# Altium schematic sheet OZ440-SE140-CAR001_sheet4_Engagement_block.SchDoc
size A3
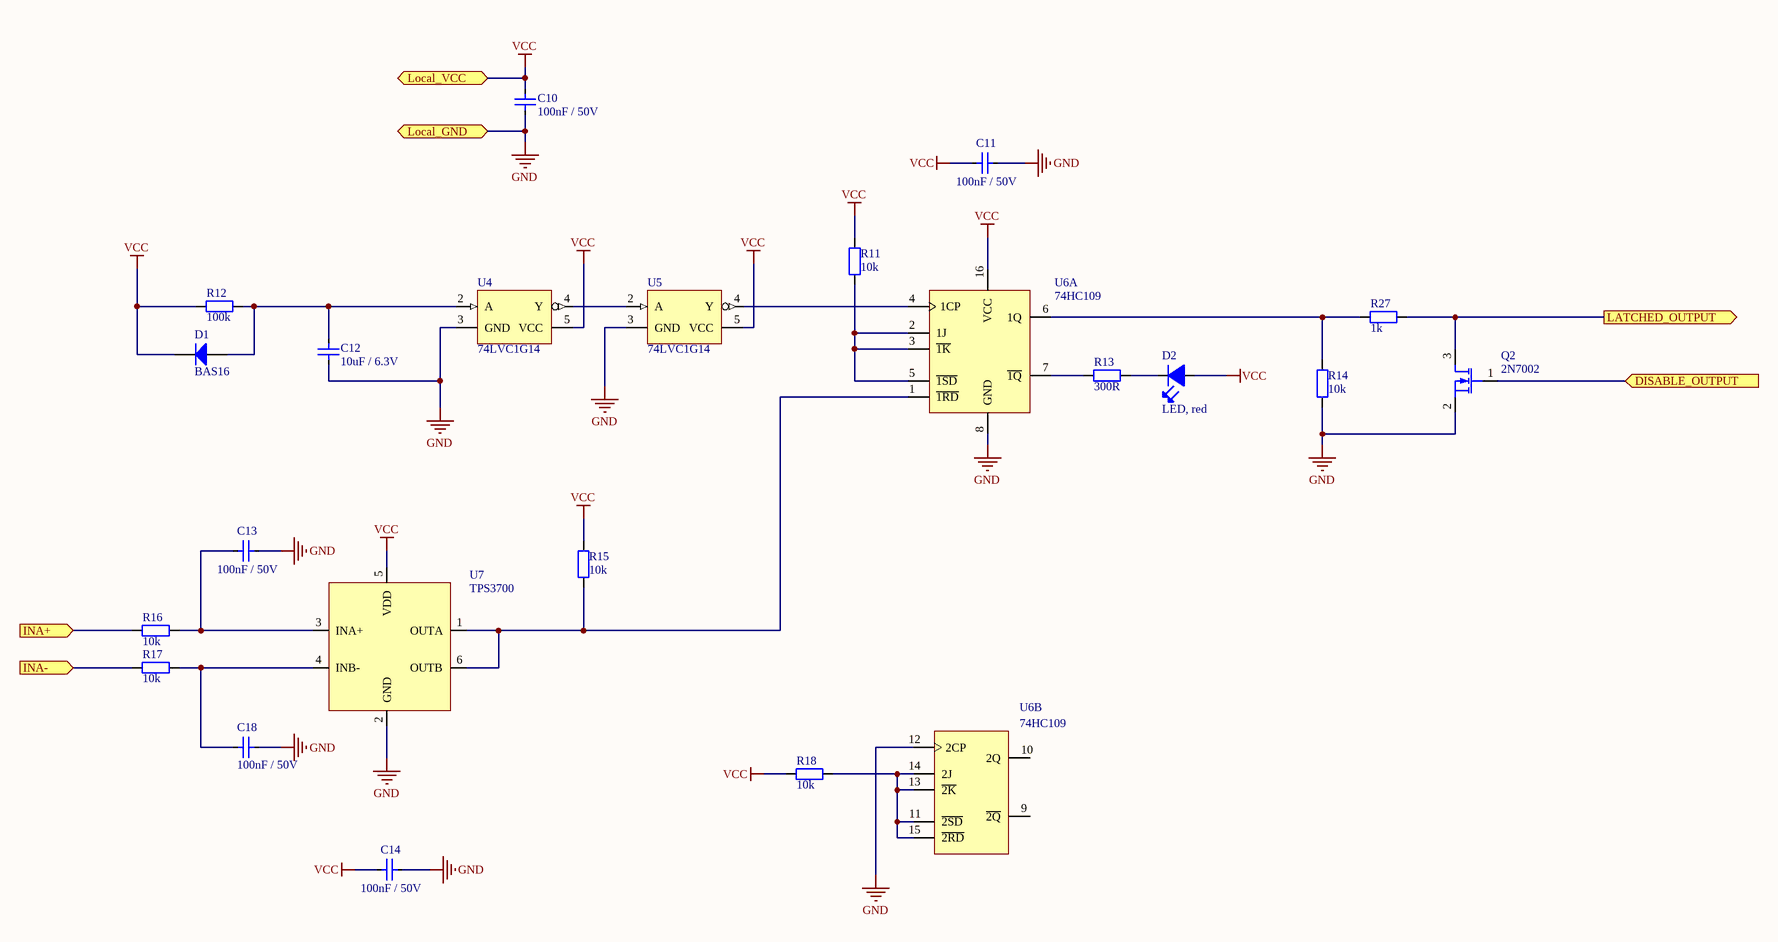
[diagram p0: OZ440-SE140-CAR001_sheet4_Engagement_block.SchDoc]

## Parts
C10  Displayed reference: 100nF / 50V  [C0805-STD]  (hidden comment: CAP-SMD)
C11  Displayed reference: 100nF / 50V  [C0805-STD]  (hidden comment: CAP-SMD)
C12  Displayed reference: 10uF / 6.3V  [C0805-STD]  (hidden comment: CAP-SMD)
C13  Displayed reference: 100nF / 50V  [C0805-STD]  (hidden comment: CAP-SMD)
C14  Displayed reference: 100nF / 50V  [C0805-STD]  (hidden comment: CAP-SMD)
C18  Displayed reference: 100nF / 50V  [C0805-STD]  (hidden comment: CAP-SMD)
D1  Displayed reference: BAS16  [SOT23-STD]  (hidden comment: BAS16-SOT23)
D2  Displayed reference: LED, red  [LED_3MM]  (hidden comment: LED)  (no BOM)
Q2  Displayed reference: 2N7002  [SOT23-SPE-2N7002]  (hidden comment: 2N7002-SMD3P)
R11  Displayed reference: 10k  [R0805-STD]  (hidden comment: RES-SMD)
R12  Displayed reference: 100k  [R0805-STD]  (hidden comment: RES-SMD)
R13  Displayed reference: 300R  [R0805-STD]  (hidden comment: RES-SMD)
R14  Displayed reference: 10k  [R0805-STD]  (hidden comment: RES-SMD)
R15  Displayed reference: 10k  [R0805-STD]  (hidden comment: RES-SMD)
R16  Displayed reference: 10k  [R0805-STD]  (hidden comment: RES-SMD)
R17  Displayed reference: 10k  [R0805-STD]  (hidden comment: RES-SMD)
R18  Displayed reference: 10k  [R0805-STD]  (hidden comment: RES-SMD)
R27  Displayed reference: 1k  [R0805-STD]  (hidden comment: RES-SMD)
U4  Displayed reference: 74LVC1G14  [SOT353-1_5pin-STD]  (hidden comment: 74xxx1G14GW-SOT353-1)
U5  Displayed reference: 74LVC1G14  [SOT353-1_5pin-STD]  (hidden comment: 74xxx1G14GW-SOT353-1)
U6  Displayed reference: 74HC109  [TSSOP16-SPE-74HC109]  (hidden comment: 74xxx109DB-TSSOP16)  (parts A,B of 2)
U7  Displayed reference: TPS3700  [SOT23_6-SPE-TPS3700]  (hidden comment: TPS3700-SOT23-6)

## Ports
DISABLE_OUTPUT (in), INA+ (in), INA- (in), LATCHED_OUTPUT (out), Local_GND, Local_VCC

## Nets
GND: C10.2 C11.2 C12.1 C13.2 C14.2 C18.2 Q2.2(S) R14.2 U4.3(GND) U5.3(GND) U6.8(GND) U6.12(2CP) U7.2(GND) ; port Local_GND
VCC: C10.1 C11.1 C14.1 D1.3(K) D2.1(A) R11.1 R12.1 R15.1 R18.1 U4.5(VCC) U5.5(VCC) U6.16(VCC) U7.5(VDD) ; port Local_VCC
DISABLE_OUTPUT: Q2.1(G) ; port DISABLE_OUTPUT
INA+: R16.1 ; port INA+
INA-: R17.1 ; port INA-
LATCHED_OUTPUT: Q2.3(D) R27.1 ; port LATCHED_OUTPUT
NetC12_2: C12.2 D1.1(A) R12.2 U4.2(A)
NetC13_1: C13.1 R16.2 U7.3(INA+)
NetC18_1: C18.1 R17.2 U7.4(INB-)
NetD2_2: D2.2 R13.2
NetR11_2: R11.2 U6.2(1J) U6.3(~{1K}) U6.5(~{1SD})
NetR13_1: R13.1 U6.7(~{1Q})
NetR14_1: R14.1 R27.2 U6.6(1Q)
NetR15_2: R15.2 U6.1(~{1RD}) U7.1(OUTA) U7.6(OUTB)
NetR18_2: R18.2 U6.11(~{2SD}) U6.13(~{2K}) U6.14(2J) U6.15(~{2RD})
NetU4_4: U4.4(Y) U5.2(A)
NetU5_4: U5.4(Y) U6.4(1CP)

Not connected (* = marked no-connect by the designer): U6 9(~{2Q}) 10(2Q)

## Notes on the sheet
- Titre document:
- NAIO TECHNOLOGIES
- 3 Av didier Daurat
- 31400 TOULOUSE
- Auteur:
- Numéro document:
- Verificateur:
- Format:
- A3
- Date:
- Revision:
- Page:
- /

## Library data of the parts
C10 C11 C13 C14 C18 = VJ0805Y104KXAxx: 0805 100nF / 50V  X7R ceramic capacitor; Manufacturer: vishay; Max Voltage: 50; Tolerance: +/- 10%; Validated: N; Reference: VJ0805Y104KXAxx; Value: 100nF; Material: X7R; Footprint description: standard Capacitor 0805; Pin Count: 2; helpURL: http://www.vishay.com/docs/45200/highrels.pdf; Supplier 1: Farnell; Supplier Part Number 1: 1612208; Supplier 2: Digi-Key; Supplier Part Number 2: 720-1266-6-ND
C12 = C0805C106K9PACxx: 0805 10uF / 6.3V X5R ceramic capacitor; Manufacturer: Kemet; Max Voltage: 6.3; Tolerance: +/- 10%; Validated: N; Reference: C0805C106K9PACxx; Value: 10uF; Material: X5R; Footprint description: standard Capacitor 0805; Pin Count: 2; helpURL: http://www.farnell.com/datasheets/40863.pdf; Supplier 1: Farnell; Supplier Part Number 1: 1643357; Supplier 2: Digi-Key; Supplier Part Number 2: 399-3138-1-ND
D1 = BAS16: 100V / 120mA signal  diode; Manufacturer: NXP; Max Voltage: 100; Max Current: 0.2A; Validated: False; Reference: BAS16; component type: DIODE; Footprint description: Sot23 SMD package; Pin Count: 3; Rev: 2010; helpURL: http://www.nxp.com/documents/data_sheet/BAS16_SER.pdf; Supplier 1: Farnell; Supplier Part Number 1: 1081180; Supplier 2: Digi-Key; Supplier Part Number 2: 568-1596-1-ND
D2 = MC20449: LED 3mm red TH; Manufacturer: MULTICOMP; Max Current: 20mA; Validated: False; Reference: MC20449; Footprint description: TH 2.54mm pitch; Pin Count: 2; Rev: A; helpURL: http://www.newark.com/pdfs/datasheets/spc/87K7075.pdf; Supplier 1: Farnell; Supplier Part Number 1: 1249909
Q2 = 2N7002: N-Channel Enhancement Mode Field Effect Transistor; Manufacturer: FAIRCHILD; Max Voltage: 60 V; Max Current: 0,4 A; Rated Power: 0,2 W; Validated: False; Reference: 2N7002; component type: NMOS; Footprint description: SOT23; Pin Count: 3; Rev: A1; helpURL: http://www.fairchildsemi.com/ds/2N/2N7000.pdf; Supplier 1: Farnell; Supplier Part Number 1: 9845313; Supplier 2: Newark; Supplier Part Number 2: 58K9651
R11 R14-R18 = CRCW080510K0FKxx: 10k Ohm 0805 SMD resistor; Manufacturer: Vishay; Value: 10 000; Tolerance: 1 %; Rated Power: 0,125 W; Validated: No; Reference: CRCW080510K0FKxx; Footprint description: standard 0805 SMD; Pin Count: 2; helpURL: http://www.vishay.com/docs/20035/dcrcwe3.pdf; Supplier 1: Farnell; Supplier Part Number 1: 1469856; Supplier 2: Mouser; Supplier Part Number 2: 71-CRCW0805-10K-E3
R12 = CRCW0805100KFKxx: 100k Ohm 0805 SMD resistor; Manufacturer: Vishay; Value: 100 000; Tolerance: 1 %; Rated Power: 0,125 W; Validated: No; Reference: CRCW0805100KFKxx; Footprint description: standard 0805 SMD; Pin Count: 2; helpURL: http://www.vishay.com/docs/20035/dcrcwe3.pdf; Supplier 1: Farnell; Supplier Part Number 1: 1469860; Supplier 2: Mouser; Supplier Part Number 2: 71-CRCW0805-100K-E3
R13 = CRCW0805300RFKxx: 300 ohm 0805 SMD resistor; Manufacturer: Vishay; Value: 300; Tolerance: 1%; Rated Power: 0.125W; Validated: No; Reference: CRCW0805300RFKxx; Footprint description: standard 0805 SMD; Pin Count: 2; helpURL: http://www.vishay.com/docs/20035/dcrcwe3.pdf; Supplier 1: Mouser; Supplier Part Number 1: 71-CRCW0805300RFKEA; Supplier 2: Farnell; Supplier Part Number 2: 1152346
R27 = CRCW08051K00FKxx: 1k Ohm 0805 SMD resistor; Manufacturer: Vishay; Value: 1 000; Tolerance: 1 %; Rated Power: 0,125 W; Validated: No; Reference: CRCW08051K00FKxx; Footprint description: standard 0805 SMD; Pin Count: 2; helpURL: http://www.vishay.com/docs/20035/dcrcwe3.pdf; Supplier 1: Farnell; Supplier Part Number 1: 1469847; Supplier 2: Mouser; Supplier Part Number 2: 71-CRCW0805-1.0K-E3
U4 U5 = 74LVC1G14GW: smith trigger inverter; Manufacturer: NXP; Max Voltage: 5,5V; Validated: False; Reference: 74LVC1G14GW; Footprint description: SOT353-1, 5 pin; Pin Count: 5; helpURL: http://www.nxp.com/documents/data_sheet/74LVC1G14.pdf; Supplier 1: Farnell; Supplier Part Number 1: 1631687; Supplier 2: Digi-Key; Supplier Part Number 2: 568-2267-1-ND
U6 = 74HC109DB: Dual JK flip-flop with set and reset; Manufacturer: NXP; Max Voltage: 6V; Validated: False; Reference: 74HC109DB; Footprint description: TSSOP16 SMT package; Pin Count: 16; helpURL: http://www.nxp.com/documents/data_sheet/74HC_HCT109_CNV.pdf; Supplier 1: Mouser; Supplier Part Number 1: 771-HC109DB112; Supplier 2: Digi-Key; Supplier Part Number 2: 74HC109DB,118-ND
U7 = TPS3700DD: Window Comparator for Over- and Undervoltage Detection; Manufacturer: TI; Max Voltage: 18; Validated: False; Reference: TPS3700DD; Footprint description: SOT23 - 6pin; Pin Count: 6; Rev: 05/2013; helpURL: http://www.ti.com/lit/ds/symlink/tps3700.pdf; Supplier 1: Farnell; Supplier Part Number 1: 2345931; Supplier 2: Mouser; Supplier Part Number 2: 595-TPS3700DDCR